# EAGLE board Relay-Board_Rack-PDU_2.1 (EAGLE 9.2.1), part 1 of 2
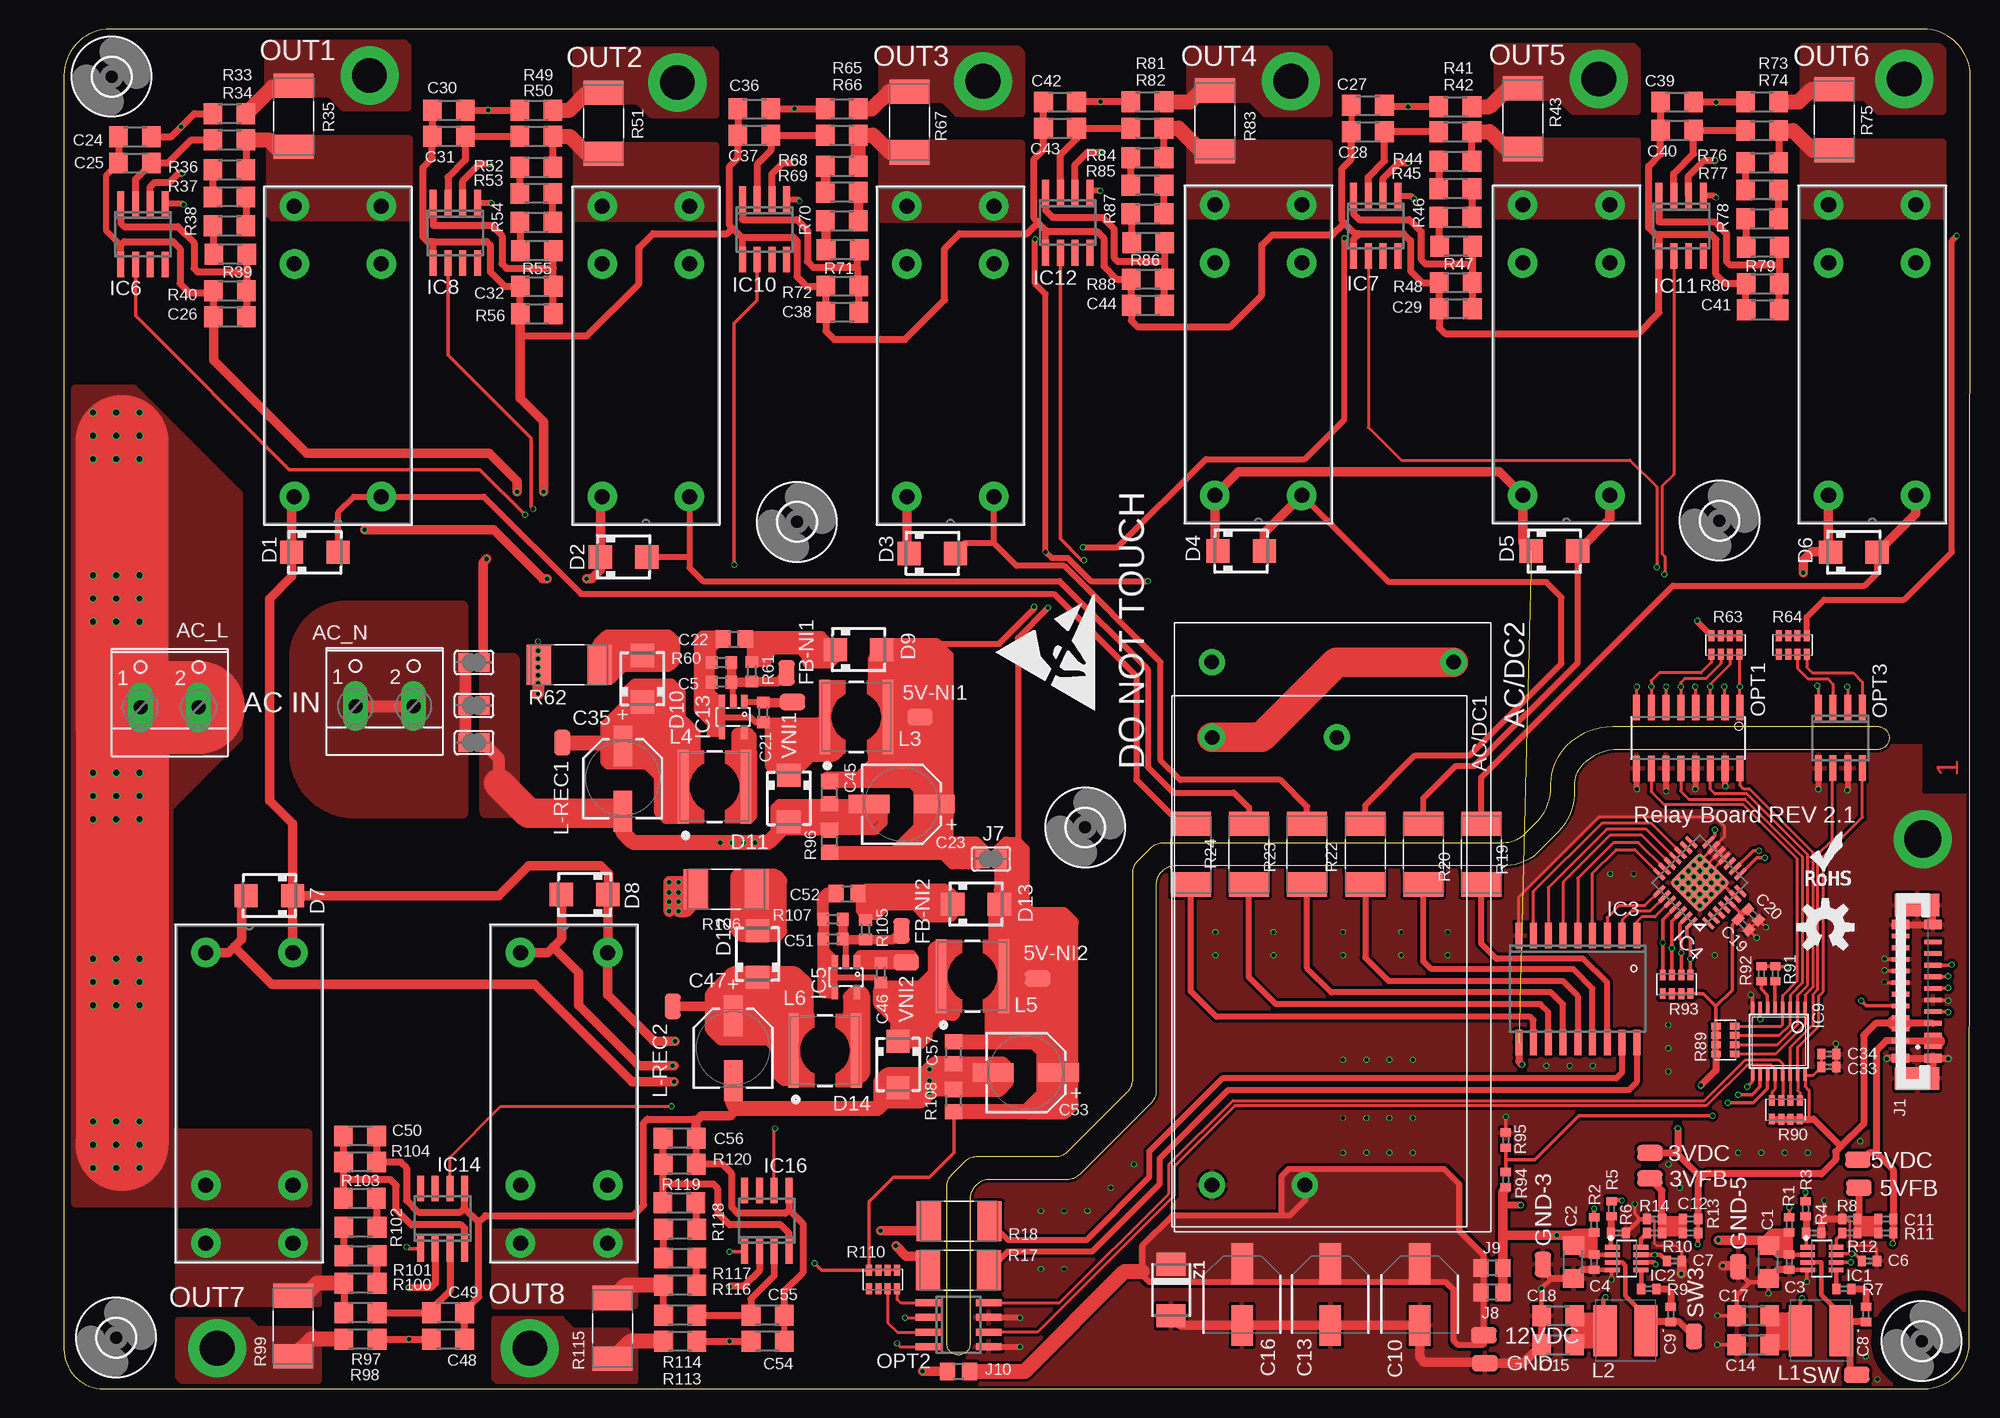
[diagram p3: board, top side]
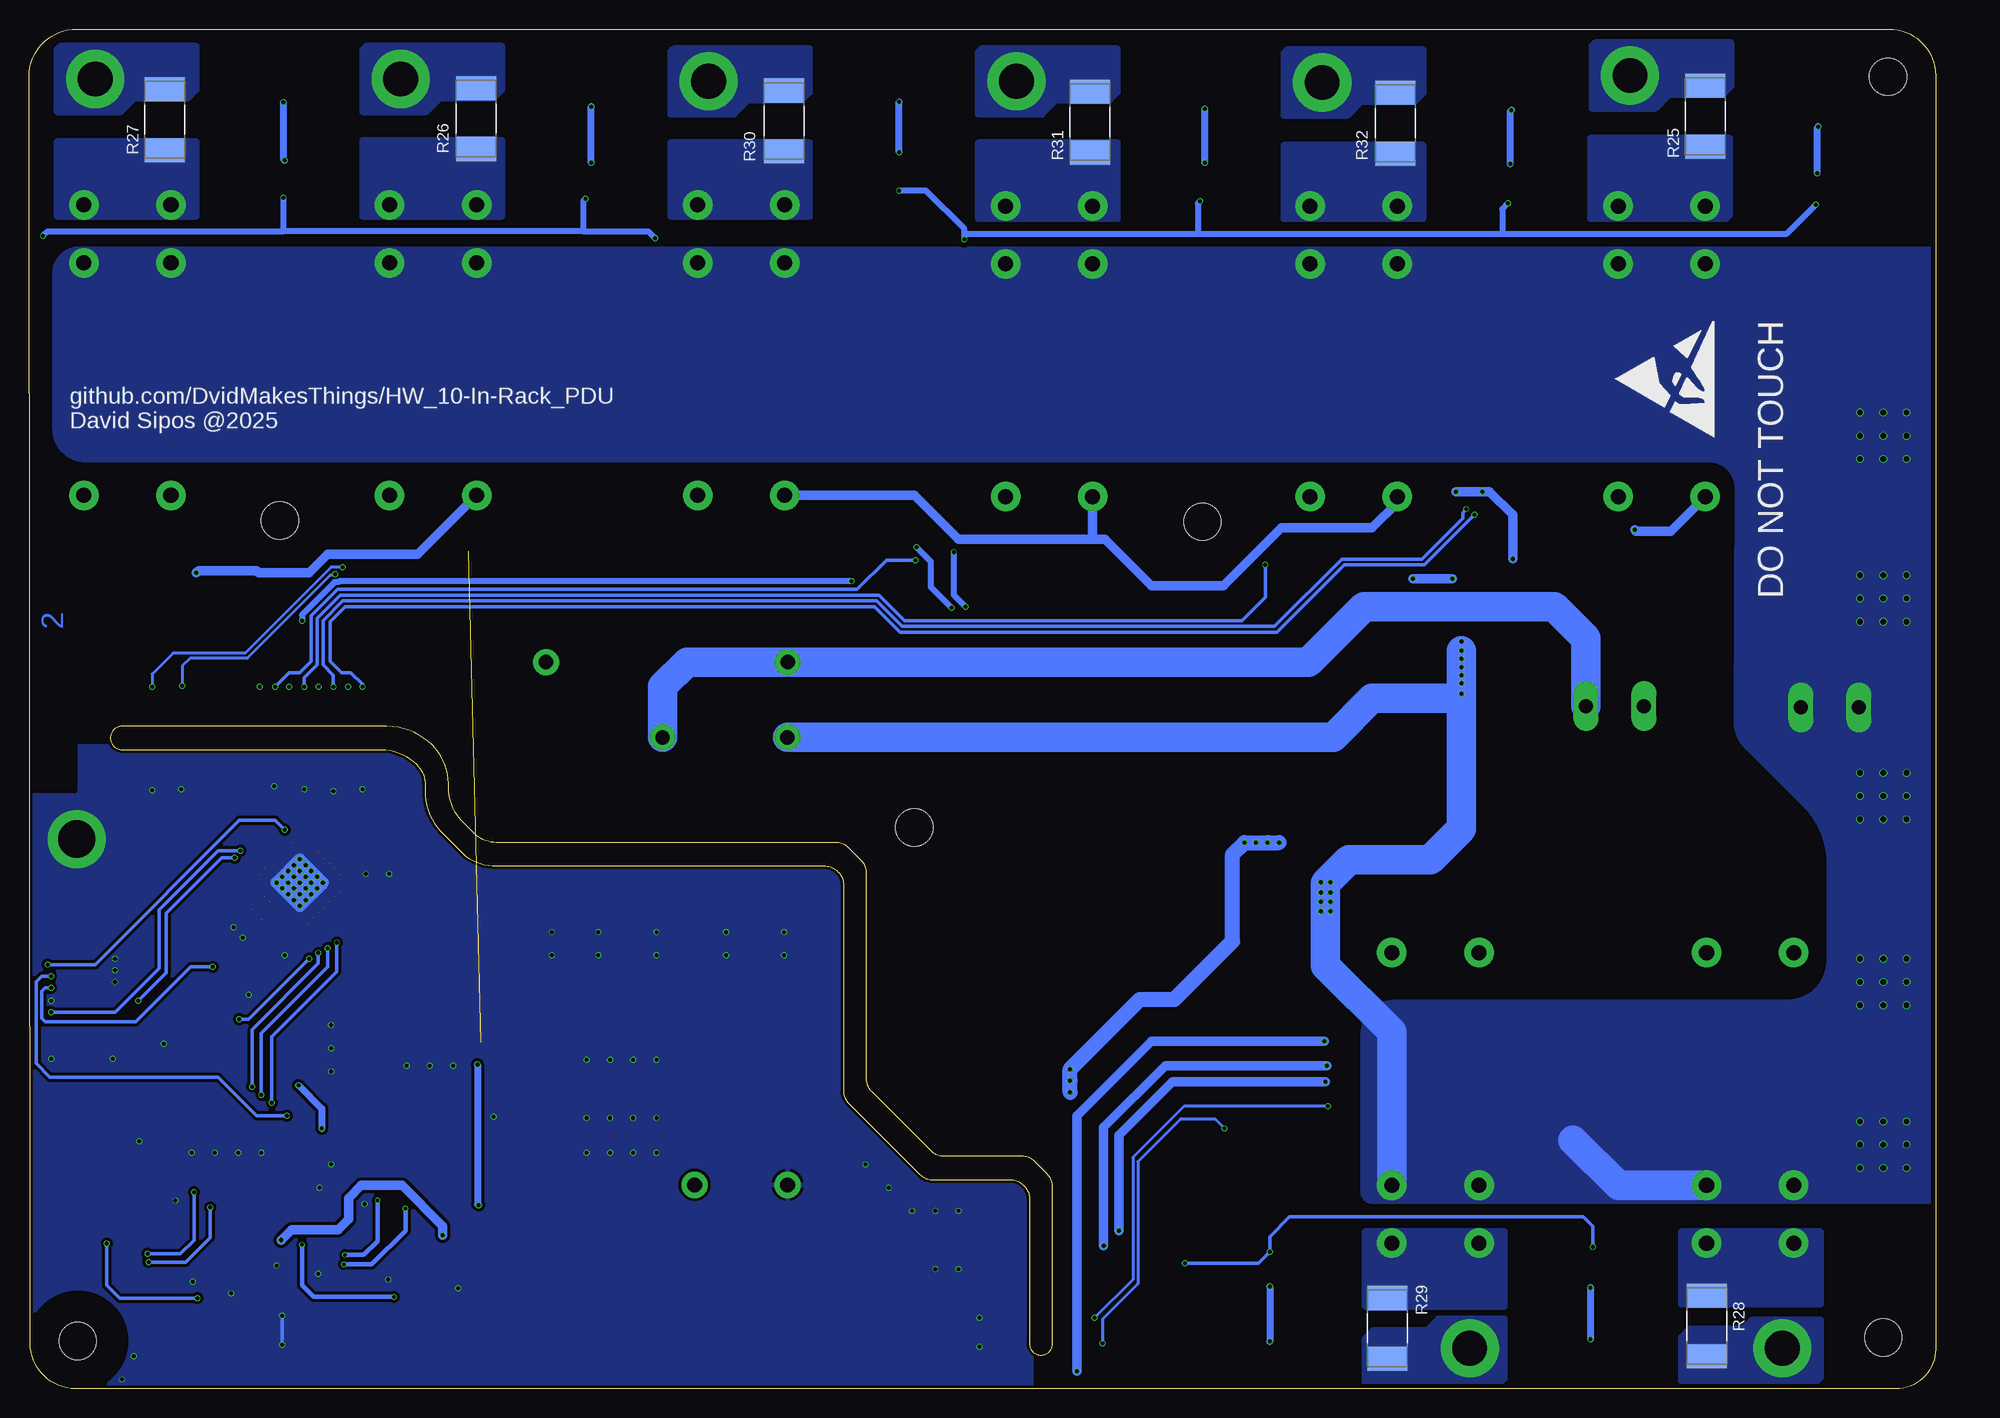
[diagram p4: board, bottom side, seen from below]

Size 164.1 x 117 mm. Coordinates in mm from the lower left corner, seen from the top.
Outline: 3.41,0 160.07,0 arc90 164,3.92 164.1,112.91 arc90 160.01,117 4,117 arc90 0,113 0,3.41 arc90 3.41,0
Outline: 78,16.38 78,3.9 arc-90 77,2.9 arc-90 76,3.9 76,17.38 arc-45 76.44,18.44 77.56,19.56 arc-45 78.62,20 85.38,20 arc45 86.44,20.44 91.56,25.56 arc45 92,26.62 92,44.38 arc-45 92.44,45.44 93.56,46.56 arc-45 94.62,47 123.88,47 arc45 125.79,47.79 126.7,48.7 arc45 128,51.84 128,52.06 arc-45 129.37,55.37 arc-45 133.31,57 156.1,57 arc-90 157.1,56 arc-90 156.1,55 133.78,55 arc45 130.75,53.74 arc45 130,51.95 130,51.09 arc-45 128.32,47.62 127.08,46.38 arc-45 124.19,45 95.71,45 arc45 94.5,44.5 94.44,44.44 arc45 94,43.38 94,25.62 arc-45 93.56,24.56 87.44,18.44 arc-45 86.38,18 79.62,18 arc45 78.56,17.56 78.44,17.44 arc45 78,16.38
Copper layers (1*16): Top 0.035mm / dielectric 1.6mm / Bottom 0.035mm
Design rules "jlcpcb-2layers": minimum track width 5mil, minimum drill 0.3mm, track to track 5mil, track to pad 5mil, pad to pad 5mil, via to via 5mil, smd to smd 5mil, copper to edge 0.2mm, drill to drill 6mil, minimum pad ring 10mil, minimum via ring 3mil, stop-mask expansion 4mil, vias tented up to drill 0mil, thermal gap 10mil
Net classes: 0 default: width 0.2 mm, drill 0.3 mm, clearance 0.191 mm

## Footprints (pad centres in the part's own frame; a part is rotated, then mirrored left to right if it is on the bottom)
TP = smd 2.2 x 1.4: TP 0,0
IRM_10_12 = drill 1.24: +V 19.25,0.02; -V 19.25,-7.98; AC_L -19.25,-7.98; AC_N -19.25,2.77
IRM_15_12 = drill 1.24: +V 23.47,-2.4; -V 23.47,-10.4; AC/L -21.53,10.4; AC/N -21.53,-10.4
W237-102 = drill 1.194 long: 1 -2.5,-1.27; 2 2.5,-1.27
C1206 = smd 1.6 x 1.803: 1 -1.422,0; 2 1.422,0
0402 = smd 0.7 x 0.9: 1 -0.65,0; 2 0.65,0
C0603 = smd 1 x 1.1: 1 -0.85,0; 2 0.85,0
100UF-16V = smd 3.5 x 1.85: 1 -2.65,0; 2 2.65,0
C0402 = smd 0.7 x 0.9: 1 -0.65,0; 2 0.65,0
C0805 = smd 1.3 x 1.5: 1 -0.95,0; 2 0.95,0
WCAP-PSHP_6.3X5.8(DXL) = smd 3.5 x 1.6: 1 2.8,0; 2 -2.8,0
WCAP-HSAH_D6.3H7.7P2.2 = smd 3.5 x 1.6: 1 -2.8,0; 2 2.8,0
SMA = smd 2 x 2: A 2,0; C -2,0
SOT65P280X110-8N = smd 1.259 x 0.4: 1 -1.228,0.975; 2 -1.228,0.325; 3 -1.228,-0.325; 4 -1.228,-0.975; 5 1.228,-0.975; 6 1.228,-0.325; 7 1.228,0.325; 8 1.228,0.975
SO18 = smd 0.6 x 2.2: 1 -5.08,-4.6; 2 -3.81,-4.6; 3 -2.54,-4.6; 4 -1.27,-4.6; 5 0,-4.6; 6 1.27,-4.6; 7 2.54,-4.6; 8 3.81,-4.6; 9 5.08,-4.6; 10 5.08,4.6; 11 3.81,4.6; 12 2.54,4.6; 13 1.27,4.6; 14 0,4.6; 15 -1.27,4.6; 16 -2.54,4.6; 17 -3.81,4.6; 18 -5.08,4.6
QFN28[6X6]ML = smd 1.27 x 0.35: 1 -2.985,1.95; 2 -2.985,1.3; 3 -2.985,0.65; 4 -2.985,0; 5 -2.985,-0.65; 6 -2.985,-1.3; 7 -2.985,-1.95; 15 2.985,-1.95; 16 2.985,-1.3; 17 2.985,-0.65; 18 2.985,0; 19 2.985,0.65; 20 2.985,1.3; 21 2.985,1.95 | smd 0.35 x 1.27: 8 -1.95,-2.985; 9 -1.3,-2.985; 10 -0.65,-2.985; 11 0,-2.985; 12 0.65,-2.985; 13 1.3,-2.985; 14 1.95,-2.985; 22 1.95,2.985; 23 1.3,2.985; 24 0.65,2.985; 25 0,2.985; 26 -0.65,2.985; 27 -1.3,2.985; 28 -1.95,2.985 | smd 3.7 x 3.7: PAD 0,0
SOT23-5 = smd 0.55 x 1.2: 1 -0.95,-1.3; 2 0,-1.3; 3 0.95,-1.3; 4 0.95,1.3; 5 -0.95,1.3
SO8 = smd 0.6 x 2.2: 1 -1.905,-2.6; 2 -0.635,-2.6; 3 0.635,-2.6; 4 1.905,-2.6; 5 1.905,2.6; 6 0.635,2.6; 7 -0.635,2.6; 8 -1.905,2.6
TSSOP16 = smd 0.305 x 0.991: 1 -2.275,-2.918; 2 -1.625,-2.918; 3 -0.975,-2.918; 4 -0.325,-2.918; 5 0.325,-2.918; 6 0.975,-2.918; 7 1.625,-2.918; 8 2.275,-2.918; 9 2.275,2.918; 10 1.625,2.918; 11 0.975,2.918; 12 0.325,2.918; 13 -0.325,2.918; 14 -0.975,2.918; 15 -1.625,2.918; 16 -2.275,2.918
FPC20 = smd 0.4 x 1.5: 1 -4.552,-1.362; 2 -4.052,1.438; 3 -3.552,-1.362; 4 -3.052,1.438; 5 -2.552,-1.362; 6 -2.052,1.438; 7 -1.552,-1.362; 8 -1.052,1.438; 9 -0.552,-1.362; 10 -0.052,1.438; 11 0.448,-1.362; 12 0.948,1.438; 13 1.448,-1.362; 14 1.948,1.438; 15 2.448,-1.362; 16 2.948,1.438; 17 3.448,-1.362; 18 3.948,1.438; 19 4.448,-1.362; 20 4.948,1.438 | smd 1.93 x 3.81: Z0 -7.303,0; Z5 7.62,0 | smd 0.8 x 1.5: Z1 -5.552,-1.362; Z2 -5.552,1.438; Z3 5.948,-1.362; Z4 5.948,1.438
SJ = smd 1.168 x 1.6: 1 -0.762,0; 2 0.762,0
0805 = smd 1.3 x 1.5: 1 -0.95,0; 2 0.95,0
RELAY_G2RL-1A-E_DC5_OMR = drill 1.295 pad 2.54: 1 -3.683,12.776; 3 -3.683,-7.239; 4 -3.683,-12.217; 5 3.81,-12.217; 6 3.81,-7.239; 8 3.81,12.776
SRR5228A = smd 4.4 x 2: 1 0,1.75; 2 0,-1.75
WE-HEPA_6030 = smd 6.4 x 0.9: 1 0,2.7; 2 0,-2.7
SO16 = smd 0.61 x 2.21: 1 -4.445,-2.616; 2 -3.175,-2.616; 3 -1.905,-2.616; 4 -0.635,-2.616; 5 0.635,-2.616; 6 1.905,-2.616; 7 3.175,-2.616; 8 4.445,-2.616; 9 4.445,2.616; 10 3.175,2.616; 11 1.905,2.616; 12 0.635,2.616; 13 -0.635,2.616; 14 -1.905,2.616; 15 -3.175,2.616; 16 -4.445,2.616
2512 = smd 2.08 x 3.44: 1 -2.616,0; 2 2.616,0
1206 = smd 1.6 x 1.803: 1 -1.422,0; 2 1.422,0
0603 = smd 1 x 1.1: 1 -0.85,0; 2 0.85,0
742C083103JP = smd 0.59 x 0.92: 1 -1.2,-0.8; 2 -0.4,-0.8; 3 0.4,-0.8; 4 1.2,-0.8; 5 1.2,0.8; 6 0.4,0.8; 7 -0.4,0.8; 8 -1.2,0.8
3,2 = hole 3.2: 0,0
SUPRESSOR_SMAJ = smd 2 x 2.5: A 2.223,0; C -2.223,0

## Placement (x,y rotation side)
3VDC  TP  [TP]  136.5,20.3 0 top
3VFB  TP  [TP]  136.5,18.1 180 top
5V-NI1  TP  [TP]  73.7,57.8 0 top
5V-NI2  TP  [TP]  83.8,35.3 0 top
5VDC  TP  [TP]  154.4,19.7 180 top
5VFB  TP  [TP]  154.5,17.3 180 top
12VDC  TP  [TP]  122.2,4.6 0 top
AC/DC1  IRM_10_12  [IRM_10_12]  106.8,36.8 270 top
AC/DC2  [IRM_15_12]  109.2,41 270 top
AC_L  [W237-102]  9.1,59.9 0 top
AC_N  [W237-102]  27.6,60 0 top
C1  22uF 25V  [C1206]  146.7,10.9 270 top
C2  22uF 25V  [C1206]  129.9,10.9 270 top
C3  100nF  [0402]  148.5,10.9 270 top
C4  100nF  [0402]  131.7,10.9 270 top
C5  1nF 50V  [C0603]  56.6,60.8 0 top
C6  100nF  [0402]  155.4,11 0 top
C7  100nF  [0402]  138.6,11 0 top
C8  100nF  [0402]  155.1,6.4 270 top
C9  100nF  [0402]  138.3,6.4 270 top
C10  100uF  [100UF-16V]  116.7,8.1 270 top
C11  33pF  [0402]  156.8,14.6 180 top
C12  33pF  [0402]  140,14.6 180 top
C13  100uF  [100UF-16V]  109,8.1 270 top
C14  22uF - 10V  [C1206]  145.4,3.8 180 top
C15  22uF - 10V  [C1206]  128.6,3.8 180 top
C16  100uF  [100UF-16V]  101.4,8.1 270 top
C17  22uF - 10V  [C1206]  145.4,6.3 180 top
C18  22uF - 10V  [C1206]  128.6,6.3 180 top
C19  100nF  [C0402]  144.55,39.94 315 top
C20  100nF  [C0402]  145.4,40.79 315 top
C21  2.2uF 10V  [C0603]  60.2,58.2 90 top
C22  220nF 16V  [C0805]  57.7,64.5 0 top
C23  100uF 16V  [WCAP-PSHP_6.3X5.8(DXL)]  72.1,50.3 0 top
C24  33nF  [C1206]  6.13,107.72 180 top
C25  33nF  [C1206]  6.13,105.48 180 top
C26  33nF  [C1206]  14.3,92.25 180 top
C27  33nF  [C1206]  112.23,110.42 180 top
C28  33nF  [C1206]  112.23,108.18 180 top
C29  33nF  [C1206]  119.8,92.95 180 top
C30  33nF  [C1206]  33.13,110.02 180 top
C31  33nF  [C1206]  33.13,107.78 180 top
C32  33nF  [C1206]  40.7,94.85 180 top
C33  100nF  [C0402]  151.9,27.7 0 top
C34  100nF  [C0402]  151.9,28.8 0 top
C35  22uF 400V  [WCAP-HSAH_D6.3H7.7P2.2]  48.1,52.5 90 top
C36  33nF  [C1206]  59.43,110.12 180 top
C37  33nF  [C1206]  59.43,107.88 180 top
C38  33nF  [C1206]  67,92.65 180 top
C39  33nF  [C1206]  138.83,110.72 180 top
C40  33nF  [C1206]  138.83,108.28 180 top
C41  33nF  [C1206]  146.2,92.85 180 top
C42  33nF  [C1206]  85.73,110.72 180 top
C43  33nF  [C1206]  85.73,108.48 180 top
C44  33nF  [C1206]  93.3,93.25 180 top
C45  1uF 50V  [C0805]  65.9,51.3 90 top
C46  2.2uF 10V  [C0603]  70.3,35.8 90 top
C47  22uF 400V  [WCAP-HSAH_D6.3H7.7P2.2]  57.6,29.3 90 top
C48  33nF  [C1206]  33.07,4.28 0 top
C49  33nF  [C1206]  33.07,6.52 0 top
C50  33nF  [C1206]  25.5,21.75 0 top
C51  1nF 50V  [C0603]  66.2,38.7 0 top
C52  220nF 16V  [C0805]  67.4,42.6 0 top
C53  100uF 16V  [WCAP-PSHP_6.3X5.8(DXL)]  82.8,27.2 0 top
C54  33nF  [C1206]  60.57,4.08 0 top
C55  33nF  [C1206]  60.57,6.32 0 top
C56  33nF  [C1206]  53,21.55 0 top
C57  1uF 50V  [C0805]  76.6,28.9 90 top
D1  MBRA340T3G  [SMA]  21.61,71.98 0 top
D2  MBRA340T3  [SMA]  48.18,71.58 0 top
D3  MBRA340T3  [SMA]  74.75,71.88 0 top
D4  MBRA340T3  [SMA]  101.32,72.08 0 top
D5  MBRA340T3  [SMA]  128.29,72.08 0 top
D6  MBRA340T3  [SMA]  154.06,71.98 0 top
D7  MBRA340T3  [SMA]  17.69,42.43 180 top
D8  MBRA340T3  [SMA]  44.82,42.53 180 top
D9  1N4007  [SMA]  68.4,63.6 0 top
D10  1N4007  [SMA]  49.8,61.1 90 top
D11  US1J  [SMA]  62.4,50.8 270 top
D12  1N4007  [SMA]  59.7,37.4 90 top
D13  1N4007  [SMA]  78.5,41.7 0 top
D14  US1J  [SMA]  71.8,27.9 270 top
FB-NI1  TP  [TP]  62.2,61.6 90 top
FB-NI2  TP  [TP]  72.1,39.4 90 top
GND  TP  [TP]  122.3,2.2 180 top
GND-3  TP  [TP]  127.3,10.7 90 top
GND-5  TP  [TP]  144.1,10.5 270 top
IC1  MP2315GJ-Z  [SOT65P280X110-8N]  151.3,11.2 0 top
IC2  MP2315S  [SOT65P280X110-8N]  134.5,11.2 0 top
IC3  ULN2803A  [SO18]  130.3,34.4 180 top
IC4  MCP23017-E/ML  [QFN28[6X6]ML]  140.81,43.55 135 top
IC5  MP150GJ  [SOT23-5]  67.3,35.4 180 top
IC6  HLW8032  [SO8]  6.8,99.35 180 top
IC7  HLW8032  [SO8]  112.9,100.05 180 top
IC8  HLW8032  [SO8]  33.7,99.45 180 top
IC9  SN74HC151PWR  [TSSOP16]  147.6,29.9 180 top
IC10  HLW8032  [SO8]  60.3,99.75 180 top
IC11  HLW8032  [SO8]  139.2,100.05 180 top
IC12  HLW8032  [SO8]  86.4,100.35 180 top
IC13  MP150GJ  [SOT23-5]  57.6,57.8 180 top
IC14  HLW8032  [SO8]  32.6,14.65 0 top
IC16  HLW8032  [SO8]  60.5,14.45 0 top
J1  FPC20-H  [FPC20]  159.5,34 90 top
J7  JP  [SJ]  79.8,45.6 0 top
J8  0R  [0805]  122.9,8.3 180 top
J9  0R  [0805]  122.9,10.4 180 top
J10  0R  [0805]  77,1.5 0 top
K1  G2RL-1A-E_DC12  [RELAY_G2RL-1A-E_DC5_OMR]  23.64,89.55 180 top
K2  G2RL-1A-E_DC12  [RELAY_G2RL-1A-E_DC5_OMR]  50.15,89.55 180 top
K3  G2RL-1A-E_DC12  [RELAY_G2RL-1A-E_DC5_OMR]  76.36,89.55 180 top
K4  G2RL-1A-E_DC12  [RELAY_G2RL-1A-E_DC5_OMR]  102.87,89.65 180 top
K5  G2RL-1A-E_DC12  [RELAY_G2RL-1A-E_DC5_OMR]  129.38,89.65 180 top
K6  G2RL-1A-E_DC12  [RELAY_G2RL-1A-E_DC5_OMR]  155.69,89.65 180 top
K7  G2RL-1A-E_DC12  [RELAY_G2RL-1A-E_DC5_OMR]  15.9,24.75 0 top
K8  G2RL-1A-E_DC12  [RELAY_G2RL-1A-E_DC5_OMR]  42.99,24.75 0 top
L1  4.9uH  [SRR5228A]  151.2,5 270 top
L2  4.2uH  [SRR5228A]  134.4,5 270 top
L3  FNR6028S102MT 1mH  [WE-HEPA_6030]  68.2,57.8 90 top
L4  FNR6028S102MT 1mH  [WE-HEPA_6030]  56,51.8 90 top
L5  FNR6028S102MT 1mH  [WE-HEPA_6030]  78.2,35.5 90 top
L6  FNR6028S102MT 1mH  [WE-HEPA_6030]  65.5,29.1 90 top
L-REC1  TP  [TP]  42.9,55.6 270 top
L-REC2  TP  [TP]  52.4,32.9 270 top
OPT1  ACPL-247  [SO16]  139.8,56 180 top
OPT2  ACPL-227  [SO8]  77,5.5 270 top
OPT3  ACPL-227  [SO8]  152.9,56 180 top
R1  499K  [0402]  148.5,14.1 90 top
R2  499K  [0402]  131.7,14.1 90 top
R3  100K  [0402]  149.9,15.5 270 top
R4  9.09K  [0402]  150.6,13.4 0 top
R5  100K  [0402]  133.2,15.5 270 top
R6  7.5K  [0402]  133.8,13.4 0 top
R7  10R  [0402]  153.2,8.6 180 top
R8  20K  [0402]  153.7,13.4 0 top
R9  10R  [0402]  136.4,8.6 180 top
R10  33K  [0402]  136.9,13.4 0 top
R11  40.2K  [0402]  156.8,13.4 180 top
R12  7.5K  [0402]  153.7,14.6 180 top
R13  40.2K  [0402]  140,13.4 180 top
R14  12.7K  [0402]  136.9,14.6 180 top
R17  330R 1W  [2512]  77,10.2 180 top
R18  330R 1W  [2512]  77.05,14.41 180 top
R19  330R 1W  [2512]  122,46 90 top
R20  330R 1W  [2512]  117,46 90 top
R21  330R 1W  [2512]  112,46 90 top
R22  330R 1W  [2512]  107,46 90 top
R23  330R 1W  [2512]  102,46 90 top
R24  330R 1W  [2512]  97,46 90 top
R25  0.002R 1%  [2512]  19.8,109.5 90 bottom
R26  0.002R 1%  [2512]  125.6,109.3 90 bottom
R27  0.002R 1%  [2512]  152.4,109.2 90 bottom
R28  0.002R 1%  [2512]  19.7,5.4 270 bottom
R29  0.002R 1%  [2512]  47.2,5.2 270 bottom
R30  0.002R 1%  [2512]  99.1,109.1 90 bottom
R31  0.002R 1%  [2512]  72.8,109 90 bottom
R32  0.002R 1%  [2512]  46.5,108.9 90 bottom
R33  1K 1%  [1206]  14.26,109.73 180 top
R34  1K 1%  [1206]  14.26,107.47 180 top
R35  0.002R 1%  [2512]  19.77,109.5 90 top
R36  470K  [1206]  14.26,104.91 180 top
R37  470K  [1206]  14.26,102.55 0 top
R38  470K  [1206]  14.26,100.09 180 top
R39  470K  [1206]  14.32,97.61 0 top
R40  1K 1%  [1206]  14.3,94.49 180 top
R41  1K 1%  [1206]  119.76,110.33 180 top
R42  1K 1%  [1206]  119.76,108.17 180 top
R43  0.002R 1%  [2512]  125.57,109.3 90 top
R44  470K  [1206]  119.76,105.61 180 top
R45  470K  [1206]  119.76,103.25 0 top
R46  470K  [1206]  119.76,100.79 180 top
R47  470K  [1206]  119.82,98.31 0 top
R48  1K 1%  [1206]  119.8,95.19 180 top
R49  1K 1%  [1206]  40.66,110.03 180 top
R50  1K 1%  [1206]  40.66,107.77 180 top
R51  0.002R 1%  [2512]  46.47,108.9 90 top
R52  470K  [1206]  40.66,105.11 180 top
R53  470K  [1206]  40.66,102.85 0 top
R54  470K  [1206]  40.66,100.39 180 top
R55  470K  [1206]  40.72,97.91 0 top
R56  1K 1%  [1206]  40.7,92.49 180 top
R57  JP  [SJ]  35.3,55.6 0 top
R58  JP  [SJ]  35.3,62.5 0 top
R59  JP  [SJ]  35.3,58.8 0 top
R60  4.99K  [0603]  56.6,62.5 180 top
R61  4.99K  [0603]  59.2,61.7 270 top
R62  10R 1W  [2512]  43.5,62.3 0 top
R63  4x1K 1206  [742C083103JP]  143,64 180 top
R64  4x1K 1206  [742C083103JP]  148.8,64 180 top
R65  1K 1%  [1206]  66.96,110.13 180 top
R66  1K 1%  [1206]  66.96,107.87 180 top
R67  0.002R 1%  [2512]  72.77,109 90 top
R68  470K  [1206]  66.96,105.21 180 top
R69  470K  [1206]  66.96,102.95 0 top
R70  470K  [1206]  66.96,100.49 180 top
R71  470K  [1206]  67.02,98.01 0 top
R72  1K 1%  [1206]  67,94.89 180 top
R73  1K 1%  [1206]  146.16,110.73 180 top
R74  1K 1%  [1206]  146.16,108.27 180 top
R75  0.002R 1%  [2512]  152.37,109.2 90 top
R76  470K  [1206]  146.16,105.51 180 top
R77  470K  [1206]  146.16,103.15 0 top
R78  470K  [1206]  146.16,100.69 180 top
R79  470K  [1206]  146.22,98.21 0 top
R80  1K 1%  [1206]  146.2,95.09 180 top
R81  1K 1%  [1206]  93.26,110.73 180 top
R82  1K 1%  [1206]  93.26,108.47 180 top
R83  0.002R 1%  [2512]  99.07,109.1 90 top
R84  470K  [1206]  93.26,105.91 180 top
R85  470K  [1206]  93.26,103.55 0 top
R86  470K  [1206]  93.26,101.09 180 top
R87  470K  [1206]  93.32,98.61 0 top
R88  1K 1%  [1206]  93.3,95.49 180 top
R89  4x1K 1206  [742C083103JP]  143,30 90 top
R90  4x1K 1206  [742C083103JP]  148.2,24 180 top
R91  0R  [0402]  147.3,35.7 90 top
R92  0R  [0402]  146.1,35.7 90 top
R93  4x10K 1206  [742C083103JP]  138.8,34.8 180 top
R94  100K  [0402]  124.1,18 270 top
R95  10K  [0402]  124.1,21.4 270 top
R96  10K  [0805]  65.9,47.1 90 top
R97  1K 1%  [1206]  25.54,4.27 0 top
R98  1K 1%  [1206]  25.54,6.53 0 top
R99  0.002R 1%  [2512]  19.73,5.4 270 top
R100  470K  [1206]  25.54,9.09 0 top
R101  470K  [1206]  25.54,11.45 180 top
R102  470K  [1206]  25.54,13.91 0 top
R103  470K  [1206]  25.48,16.39 180 top
R104  1K 1%  [1206]  25.5,19.51 0 top
R105  4.99K  [0603]  69,39.5 270 top
R106  10R 1W  [2512]  57,43 0 top
R107  4.99K  [0603]  66.2,40.4 180 top
R108  10K  [0805]  76.6,24.8 90 top
R110  4x1K 1206  [742C083103JP]  70.5,9.4 180 top
R113  1K 1%  [1206]  53.04,4.07 0 top
R114  1K 1%  [1206]  53.04,6.33 0 top
R115  0.002R 1%  [2512]  47.23,5.2 270 top
R116  470K  [1206]  53.04,8.89 0 top
R117  470K  [1206]  53.04,11.25 180 top
R118  470K  [1206]  53.04,13.71 0 top
R119  470K  [1206]  52.98,15.99 180 top
R120  1K 1%  [1206]  53,19.31 0 top
SW  TP  [TP]  154.3,1.2 180 top
SW3  TP  [TP]  140.3,4.5 90 top
U$1  [ESD_10.00]  19,81.8 90 bottom
U$2  [ESD_10.00]  88.8,58.3 90 top
U$3  [2-LAYER]  164,51.5 90 top
U$4  [3,2]  4.1,112.9 0 top
U$5  [3,2]  142.5,74.7 0 top
U$6  [3,2]  4.5,4.4 0 top
U$7  [3,2]  159.9,4.1 0 top
U$8  [3,2]  63.1,74.6 0 top
U$9  [3,2]  87.9,48.3 0 top
U$10  [OSHW-LOGO-M]  151.6,39.7 0 top
U$11  [ROHS_LOGO_0.18_IN]  149.7,43.2 0 top
VNI1  TP  [TP]  62.7,59.1 180 top
VNI2  TP  [TP]  72.5,36.7 0 top
Z1  SMAJ15A  [SUPRESSOR_SMAJ]  95.3,8.5 270 top